# Altium schematic sheet 03-POWER_CTRL.SchDoc
size B
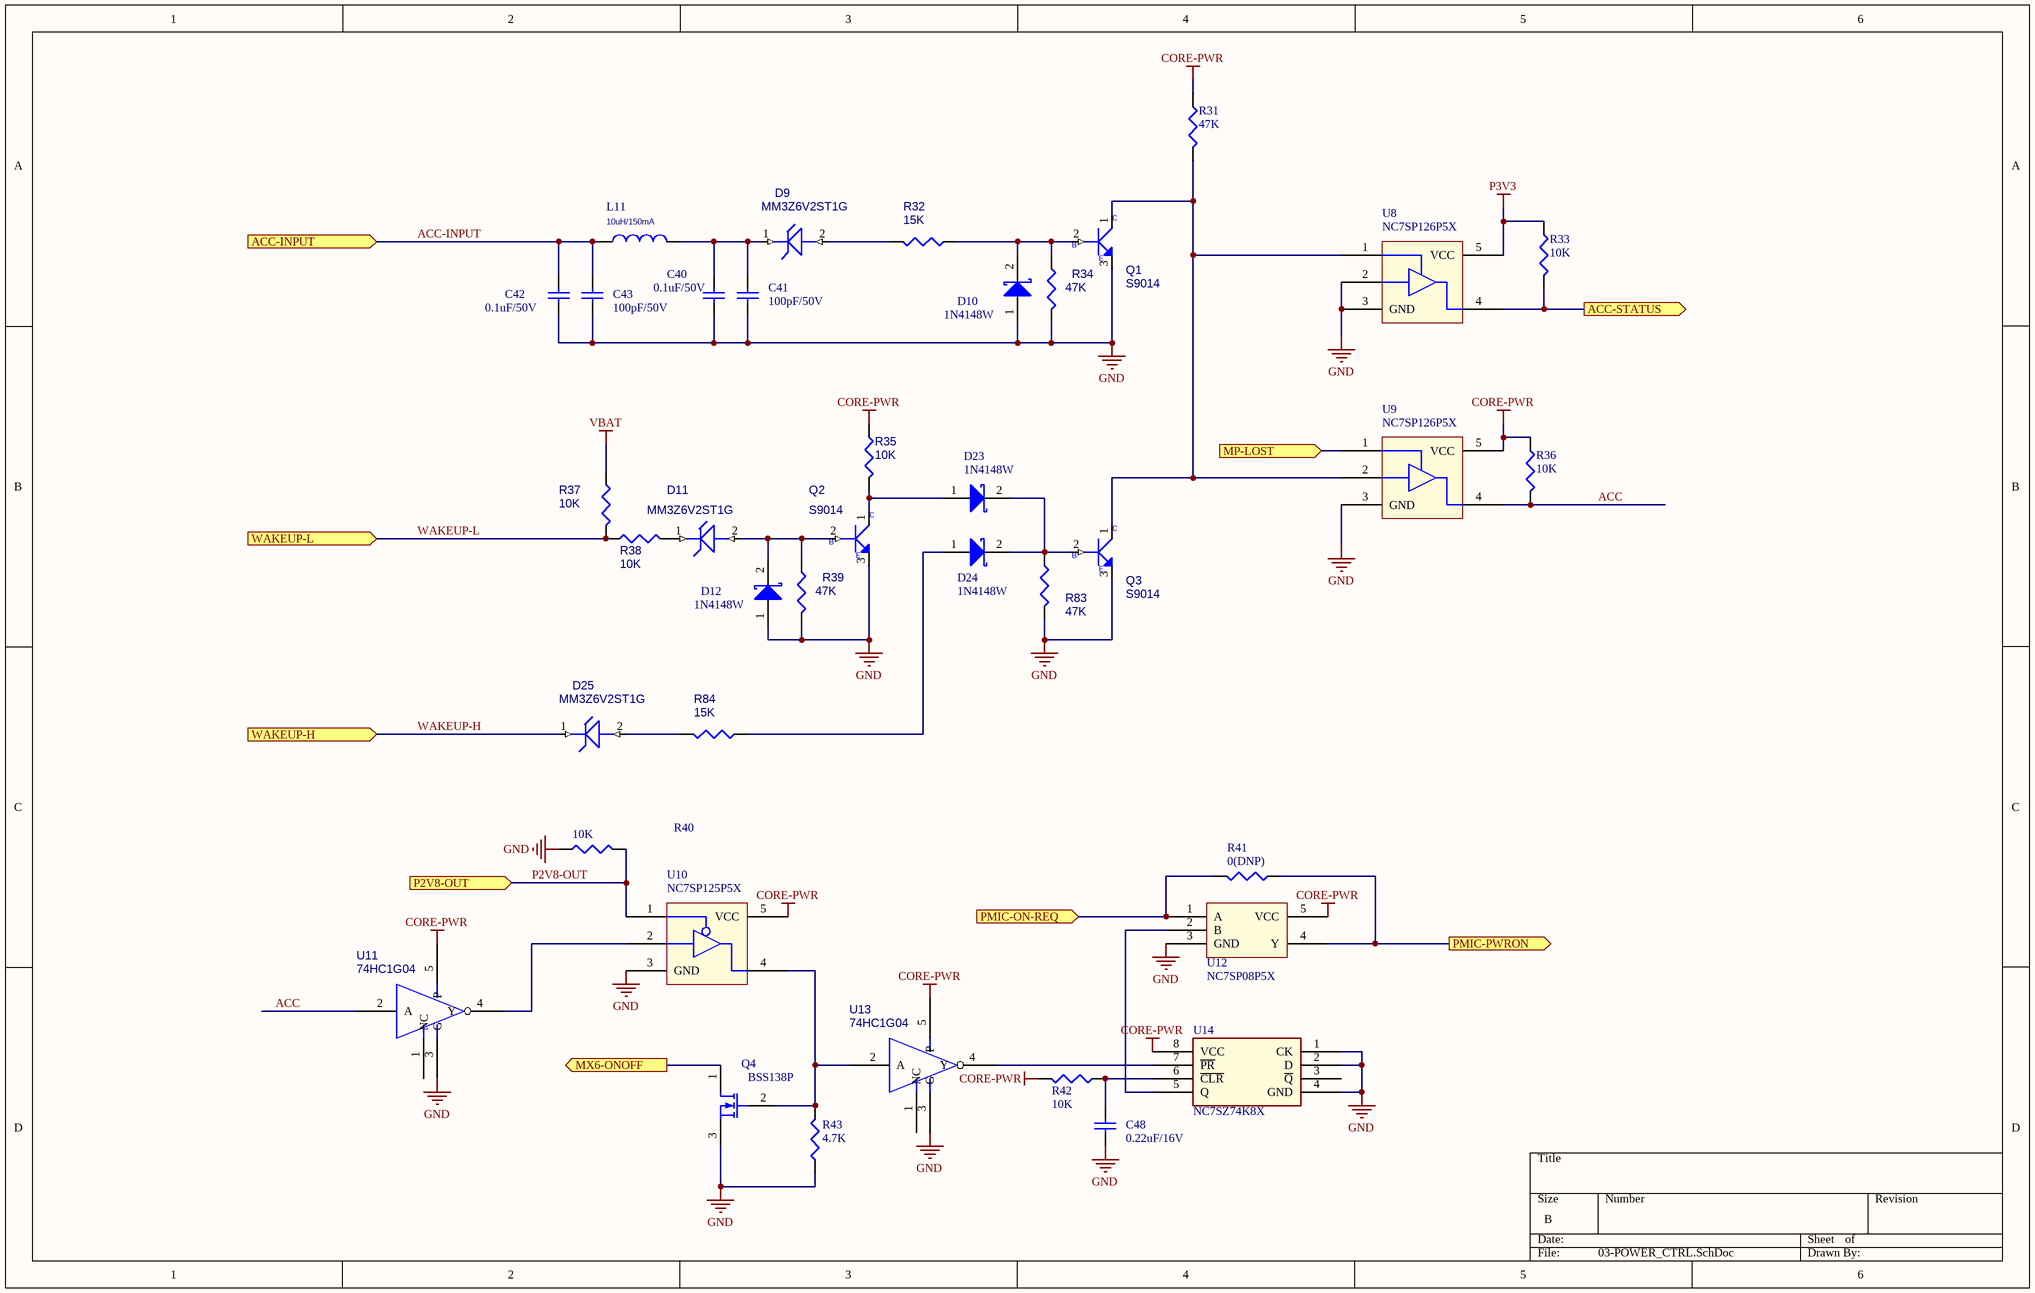
[diagram p0: 03-POWER_CTRL.SchDoc]

## Parts
C40  0.1uF/50V  [0402]
C41  100pF/50V  [0402]
C42  0.1uF/50V  [0402]
C43  100pF/50V  [0402]
C48  0.22uF/16V  [0402]
D9  MM3Z6V2ST1G  [SOD323]
D10  1N4148W  [SOD123]
D11  MM3Z6V2ST1G  [SOD323]
D12  1N4148W  [SOD123]
D23  1N4148W  [SOD123]
D24  1N4148W  [SOD123]
D25  MM3Z6V2ST1G  [SOD323]
L11  10uH/150mA  [NLFV25]
Q1  S9014  [NPN]
Q2  S9014  [NPN]
Q3  S9014  [NPN]
Q4  BSS138P  [NPN]
R31  47K  [0402]
R32  15K  [0805]
R33  10K  [0402]
R34  47K  [0402]
R35  10K  [0402]
R36  10K  [0402]
R37  10K  [0805]
R38  10K  [0805]
R39  47K  [0402]
R40  10K  [0402]
R41  0(DNP)  [0402]
R42  10K  [0402]
R43  4.7K  [0402]
R83  47K  [0402]
R84  15K  [0805]
U8  NC7SP126P5X  [SC70]
U9  NC7SP126P5X  [SC70]
U10  NC7SP125P5X  [SC70]
U11  74HC1G04  [SOT753]
U12  NC7SP08P5X  [SC70]
U13  74HC1G04  [SOT753]
U14  NC7SZ74K8X  [US8]

## Ports
ACC-INPUT (in), ACC-STATUS (out), MP-LOST (in), MX6-ONOFF (out), P2V8-OUT (in), PMIC-ON-REQ (in), PMIC-PWRON (out), WAKEUP-H (in), WAKEUP-L (in)

## Nets
CORE-PWR: R31.1 R35.1 R36.1 R42.1 U9.5(VCC) U10.5(VCC) U11.5(P) U12.5(VCC) U13.5(P) U14.8(VCC)
GND: C40.2 C41.2 C42.2 C43.2 C48.2 D10.1(A) D12.1(A) Q1.3(EMITTER) Q2.3(EMITTER) Q3.3(EMITTER) Q4.3(S) R34.2 R39.2 R40.2 R43.2 R83.2 U8.2(A) U8.3(GND) U9.3(GND) U10.3(GND) U11.3(G) U12.3(GND) U13.3(G) U14.1(CK) U14.2(D) U14.4(GND)
P3V3: R33.1 U8.5(VCC)
VBAT: R37.1
ACC: R36.2 U9.4(Y) U11.2(A)
ACC-INPUT: C42.1 C43.1 L11.2 ; port ACC-INPUT
ACC-STATUS: R33.2 U8.4(Y) ; port ACC-STATUS
MP-LOST: U9.1(OE) ; port MP-LOST
MX6-ONOFF: Q4.1(D) ; port MX6-ONOFF
P2V8-OUT: R40.1 U10.1(OE) ; port P2V8-OUT
PMIC-ON-REQ: R41.1 U12.1(A) ; port PMIC-ON-REQ
PMIC-PWRON: R41.2 U12.4(Y) ; port PMIC-PWRON
WAKEUP-H: D25.1 ; port WAKEUP-H
WAKEUP-L: R37.2 R38.1 ; port WAKEUP-L
NetC40_1: C40.1 C41.1 D9.1 L11.1
NetC48_1: C48.1 R42.2 U14.6(~{CLR})
NetD9_2: D9.2 R32.2
NetD10_2: D10.2(K) Q1.2(BASE) R32.1 R34.1
NetD11_1: D11.1 R38.2
NetD11_2: D11.2 D12.2(K) Q2.2(BASE) R39.1
NetD23_1: D23.1(A) Q2.1(COLLECTOR) R35.2
NetD23_2: D23.2(K) D24.2(K) Q3.2(BASE) R83.1
NetD24_1: D24.1(A) R84.1
NetD25_2: D25.2 R84.2
NetQ1_1: Q1.1(COLLECTOR) Q3.1(COLLECTOR) R31.2 U8.1(OE) U9.2(A)
NetQ4_2: Q4.2(G) R43.1 U10.4(Y) U13.2(A)
NetU10_2: U10.2(A) U11.4(Y)
NetU12_2: U12.2(B) U14.5(Q)
NetU13_4: U13.4(Y) U14.7(~{PR})

Not connected (* = marked no-connect by the designer): U11 1(NC); U13 1(NC); U14 3(~{Q})

## Notes on the sheet
- (in symbol MMBT3904_NL_SOT23-3) C; B; E

## Library data of the parts
C40-C43 C48 = Cap: Capacitor; Published: 8-Jun-2000; LatestRevisionDate: 17-Jul-2002; LatestRevisionNote: Re-released for DXP Platform.; PackageReference: RAD-0.3; Publisher: Altium Limited; PackageDescription: Radial Cap, Thru-Hole; 2 Leads; 0.3 in Pin Spacing
D9 D11 D25 = MMGZ5231BPTLL34
D10 D12 D23 D24 = Diode 11DQ03: Schottky Rectifier
L11 = L_0: REF: NLFV25T-100K; FAB: TDK; DESIG: Inductor; VAL: 10uH/150mA
Q1-Q3 = MMBT3904_NL_SOT23-3: Part Description: S TR MMBT3904_NL NPN SOT23; Part Number: SB039040000
Q4 = MOSFET-N: N-Channel MOSFET; Published: 8-Jun-2000; LatestRevisionDate: 17-Jul-2002; LatestRevisionNote: Re-released for DXP Platform.; PackageVersion: 1995/1996; PackageReference: E3; Publisher: Altium Limited; PackageDescription: TO, Flat Index; 3 In-Line, Axial Leads; Body Dia. 4.6mm; Lead Dia. 0.5 mm (max)
R31 R33 R36 R40 = CR16-1003FM
R32 R34 R35 R37-R39 R83 R84 = R
R41-R43 = Res3: Resistor; Value: 0.1/1W; Published: 8-Jun-2000; LatestRevisionDate: 29-May-2009; LatestRevisionNote: IPC-7351 Footprint Added.; PackageReference: J1-0603; Publisher: Altium Limited; PackageDescription: Chip Resistor
U11 U13 = 74LVC1G04GW_SOT353-5: Part  Number: SA00000FX00
U14 = NC7SZ74-US8_0: IC;NC7SZ74,D-TYPE FLIP-FLOP,US8; VENDER: FAIRCHILD; P/N: XXXXXXXXXXXX; PKG: US8; device: US8